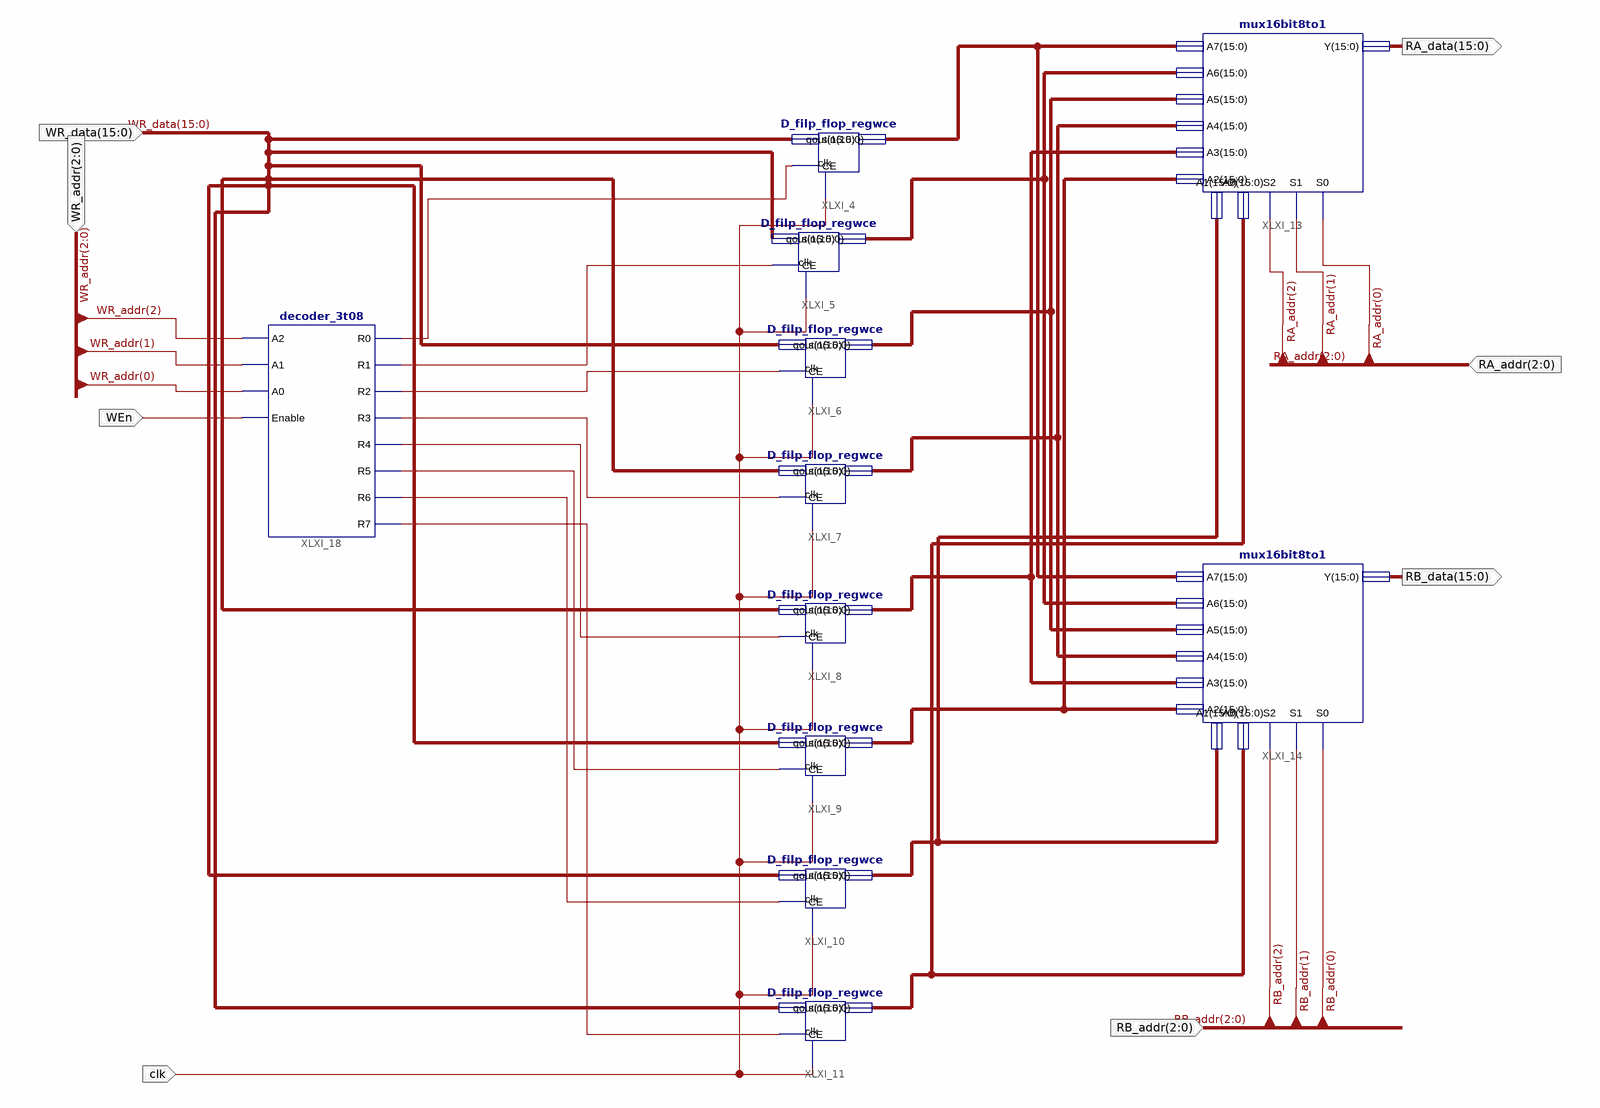
[diagram p0: schematic sheet 1]
// Xilinx ISE schematic regfile.sch (spartan3e) as structural Verilog: 11 symbols, 8 ports
module regfile (
  input  WEn,
  input  clk,
  input  [15:0] WR_data,
  input  [2:0] WR_addr,
  input  [2:0] RB_addr,
  input  [2:0] RA_addr,
  output [15:0] RB_data,
  output [15:0] RA_data
);

  wire XLXN_89, XLXN_90, XLXN_92, XLXN_93, XLXN_94, XLXN_95, XLXN_96, XLXN_97;
  wire [15:0] XLXN_34, XLXN_37, XLXN_39, XLXN_41, XLXN_43, XLXN_44, XLXN_46, XLXN_48;

  D_filp_flop_regwce XLXI_4 (.CE(XLXN_89), .clk(clk), .qout(XLXN_34), .sin(WR_data));
  D_filp_flop_regwce XLXI_5 (.CE(XLXN_90), .clk(clk), .qout(XLXN_37), .sin(WR_data));
  D_filp_flop_regwce XLXI_6 (.CE(XLXN_92), .clk(clk), .qout(XLXN_39), .sin(WR_data));
  D_filp_flop_regwce XLXI_7 (.CE(XLXN_93), .clk(clk), .qout(XLXN_41), .sin(WR_data));
  D_filp_flop_regwce XLXI_8 (.CE(XLXN_94), .clk(clk), .qout(XLXN_43), .sin(WR_data));
  D_filp_flop_regwce XLXI_9 (.CE(XLXN_95), .clk(clk), .qout(XLXN_44), .sin(WR_data));
  D_filp_flop_regwce XLXI_10 (.CE(XLXN_96), .clk(clk), .qout(XLXN_46), .sin(WR_data));
  D_filp_flop_regwce XLXI_11 (.CE(XLXN_97), .clk(clk), .qout(XLXN_48), .sin(WR_data));
  mux16bit8to1 XLXI_13 (
    .A7(XLXN_34), .A6(XLXN_37), .A5(XLXN_39), .A4(XLXN_41), .A3(XLXN_43), .A2(XLXN_44), .A1(XLXN_46),
    .A0(XLXN_48), .S2(RA_addr[2]), .S1(RA_addr[1]), .S0(RA_addr[0]), .Y(RA_data));
  mux16bit8to1 XLXI_14 (
    .A7(XLXN_34), .A6(XLXN_37), .A5(XLXN_39), .A4(XLXN_41), .A3(XLXN_43), .A2(XLXN_44), .A1(XLXN_46),
    .A0(XLXN_48), .S2(RB_addr[2]), .S1(RB_addr[1]), .S0(RB_addr[0]), .Y(RB_data));
  decoder_3t08 XLXI_18 (
    .A0(WR_addr[0]), .A1(WR_addr[1]), .A2(WR_addr[2]), .Enable(WEn), .R0(XLXN_89), .R1(XLXN_90),
    .R2(XLXN_92), .R3(XLXN_93), .R4(XLXN_94), .R5(XLXN_95), .R6(XLXN_96), .R7(XLXN_97));
endmodule
